# Altium schematic sheet ControladorPOE.SchDoc
size A4; SheetNumber: 8; SheetTotal: 10
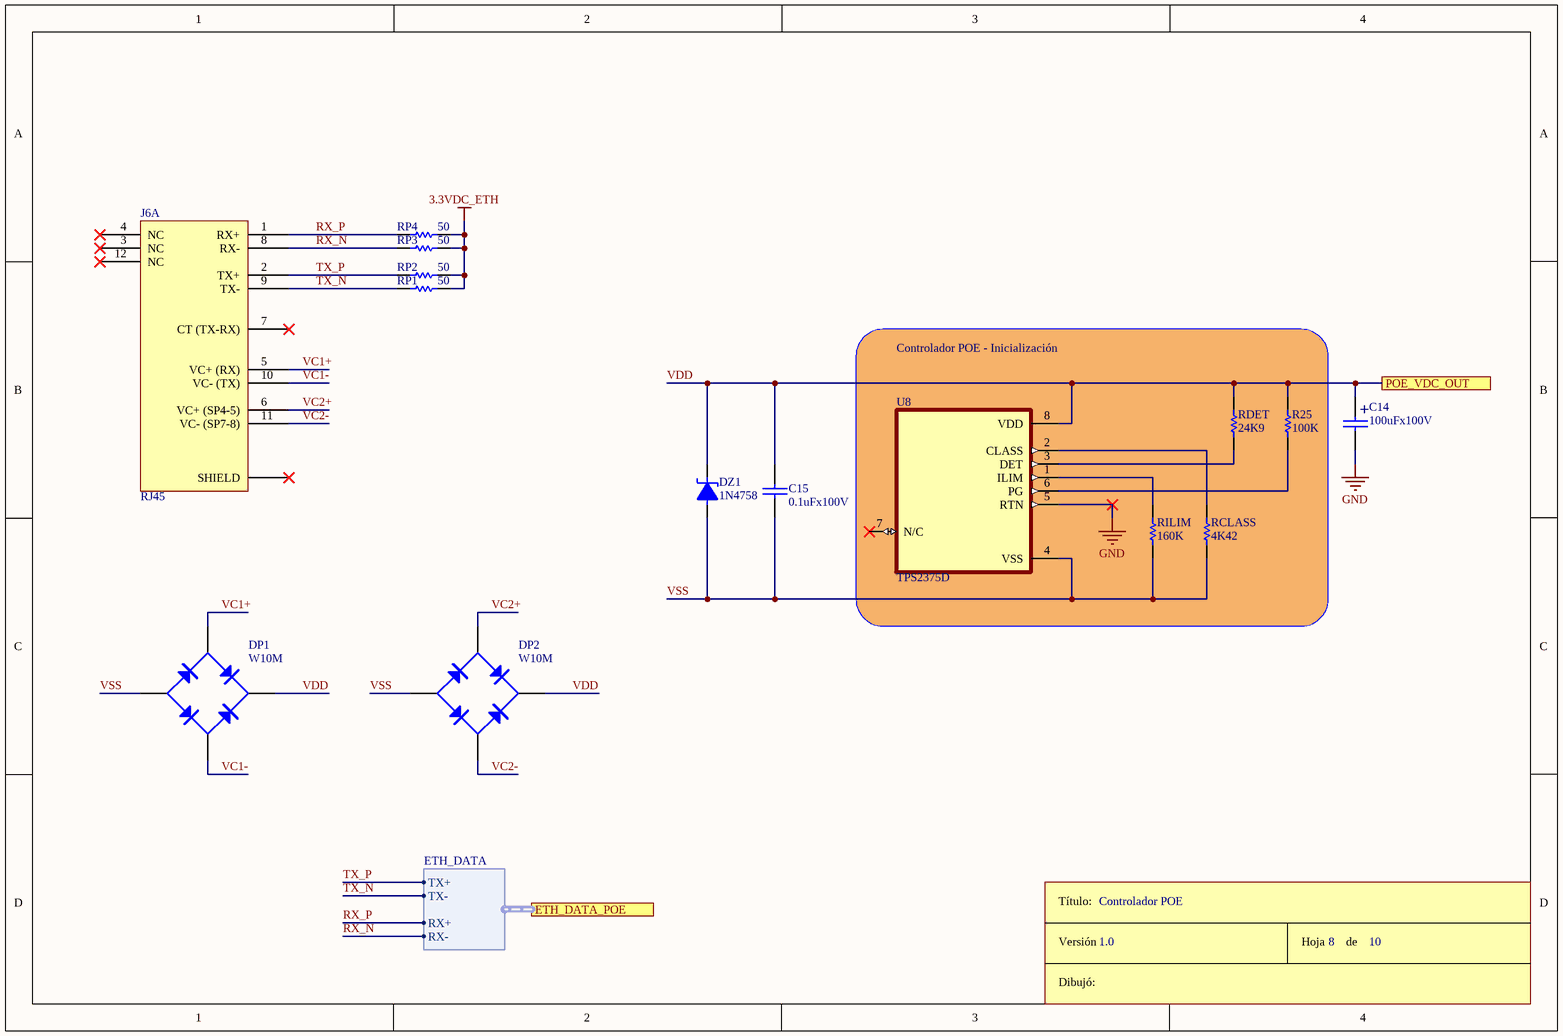
[diagram p0: ControladorPOE.SchDoc]

## Parts
C14  100uFx100V  [CAP200RP]
C15  0.1uFx100V  [CAP300]
DP1  W10M  [PUENTE - W10M]
DP2  W10M  [PUENTE - W10M]
DZ1  1N4758  [DO41]
J6A  RJ45  [ARJP11C-MB]
R25  100K  [RES300]
RCLASS  4K42  [RES300]
RDET  24K9  [RES300]
RILIM  160K  [RES300]
ROT7  Rótulo  (value not drawn)  (graphical)
RP1  50  [1206]
RP2  50  [1206]
RP3  50  [1206]
RP4  50  [1206]
U8  TPS2375D  [SOIC127P599X175-8N]

## Blocks framed on the sheet
Controlador POE - Inicialización: R25 RCLASS RDET RILIM U8

## Ports
ETH_DATA_POE (harness ETH_DATA), POE_VDC_OUT

## Harnesses
ETH_DATA: TX+, TX-, RX+, RX-

## Nets
3.3VDC_ETH: RP1.2 RP2.2 RP3.2 RP4.2
GND: C14.2 U8.5(RTN)
RX_N: J6A.8(RX-) RP3.1 ; port ETH_DATA_POE.RX-
RX_P: J6A.1(RX+) RP4.1 ; port ETH_DATA_POE.RX+
TX_N: J6A.9(TX-) RP1.1 ; port ETH_DATA_POE.TX-
TX_P: J6A.2(TX+) RP2.1 ; port ETH_DATA_POE.TX+
VC1+: DP1.2(AC) J6A.5(VC+_(RX))
VC1-: DP1.4(AC) J6A.10(VC-_(TX))
VC2+: DP2.2(AC) J6A.6(VC+_(SP4-5))
VC2-: DP2.4(AC) J6A.11(VC-_(SP7-8))
VDD: C14.1 C15.1 DP1.1(V+) DP2.1(V+) DZ1.2 R25.2 RDET.2 U8.8(VDD) ; port POE_VDC_OUT
VSS: C15.2 DP1.3(V-) DP2.3(V-) DZ1.1 RCLASS.1 RILIM.1 U8.4(VSS)
NetR25_1: R25.1 U8.6(PG)
NetRCLASS_2: RCLASS.2 U8.2(CLASS)
NetRDET_1: RDET.1 U8.3(DET)
NetRILIM_2: RILIM.2 U8.1(ILIM)

Not connected (* = marked no-connect by the designer): J6A 3(NC)* 4(NC)* 7(CT_(TX-RX))* 12(NC)* SHIELD*; U8 7(N/C)*

## Notes on the sheet
- Controlador POE
- 1.0
- 8
- 10
- (in symbol CAPPOL) +
- (in symbol Rótulo) Título:; Versión; Hoja       de; Dibujó:

## Library data of the parts
C14 = CAPPOL
C15 = CAP
DP1 DP2 = W10M: Bridge Rectifier TH 1000V 1.5A
DZ1 = DIODO ZENER
J6A = ARJP11C-MBSC-L2: Magjack Connector for PoE
R25 RCLASS RDET RILIM RP1-RP4 = RES
U8 = TPS2375D: Class 3 PoE PD with latch protection 8-SOIC -40 to 85; MF: Texas Instruments; Purchase-URL: https://pricing.snapeda.com/search/part/TPS2375D/?ref=eda; MP: TPS2375D; Package: SOIC-8 Texas Instruments; SnapEDA_Link: https://www.snapeda.com/parts/TPS2375D/Texas%20Instruments/view-part/570877/?ref=snap; Value: *; Check_prices: https://www.snapeda.com/parts/TPS2375D/Texas%20Instruments/view-part/570877/?ref=eda; Digi-Key_Part_Number: 296-26922-2-ND